# EAGLE design mptt-controller (EAGLE 9.6.1)

## Sheet 1 of 2
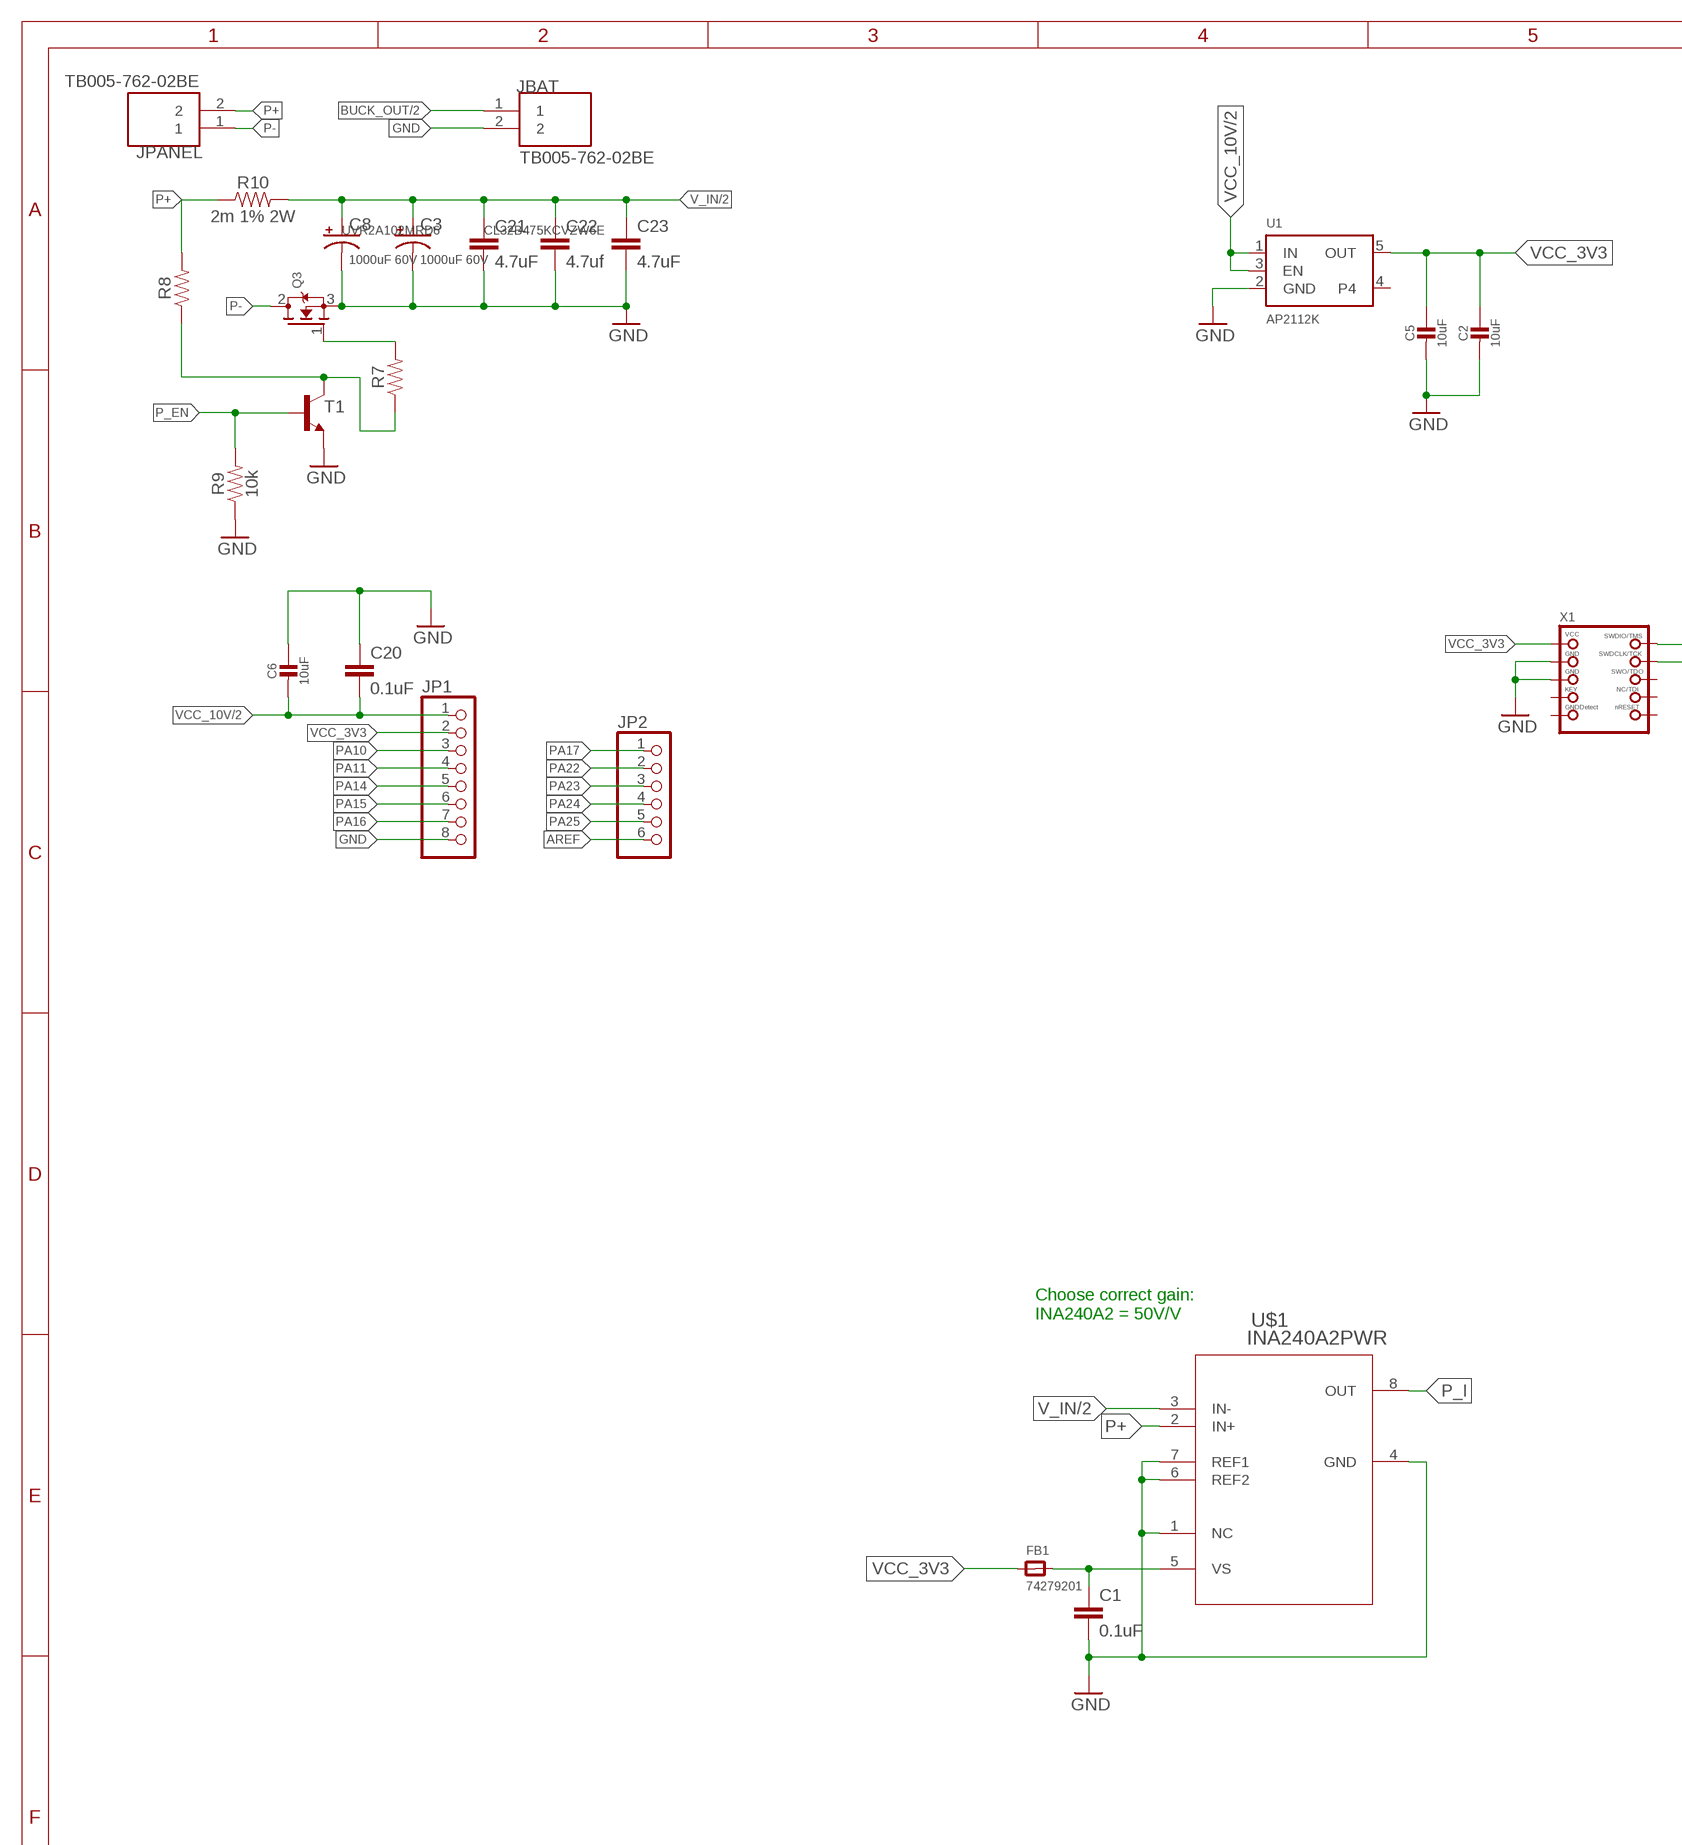
[diagram p0: schematic, sheet 1, part 1 of 2]
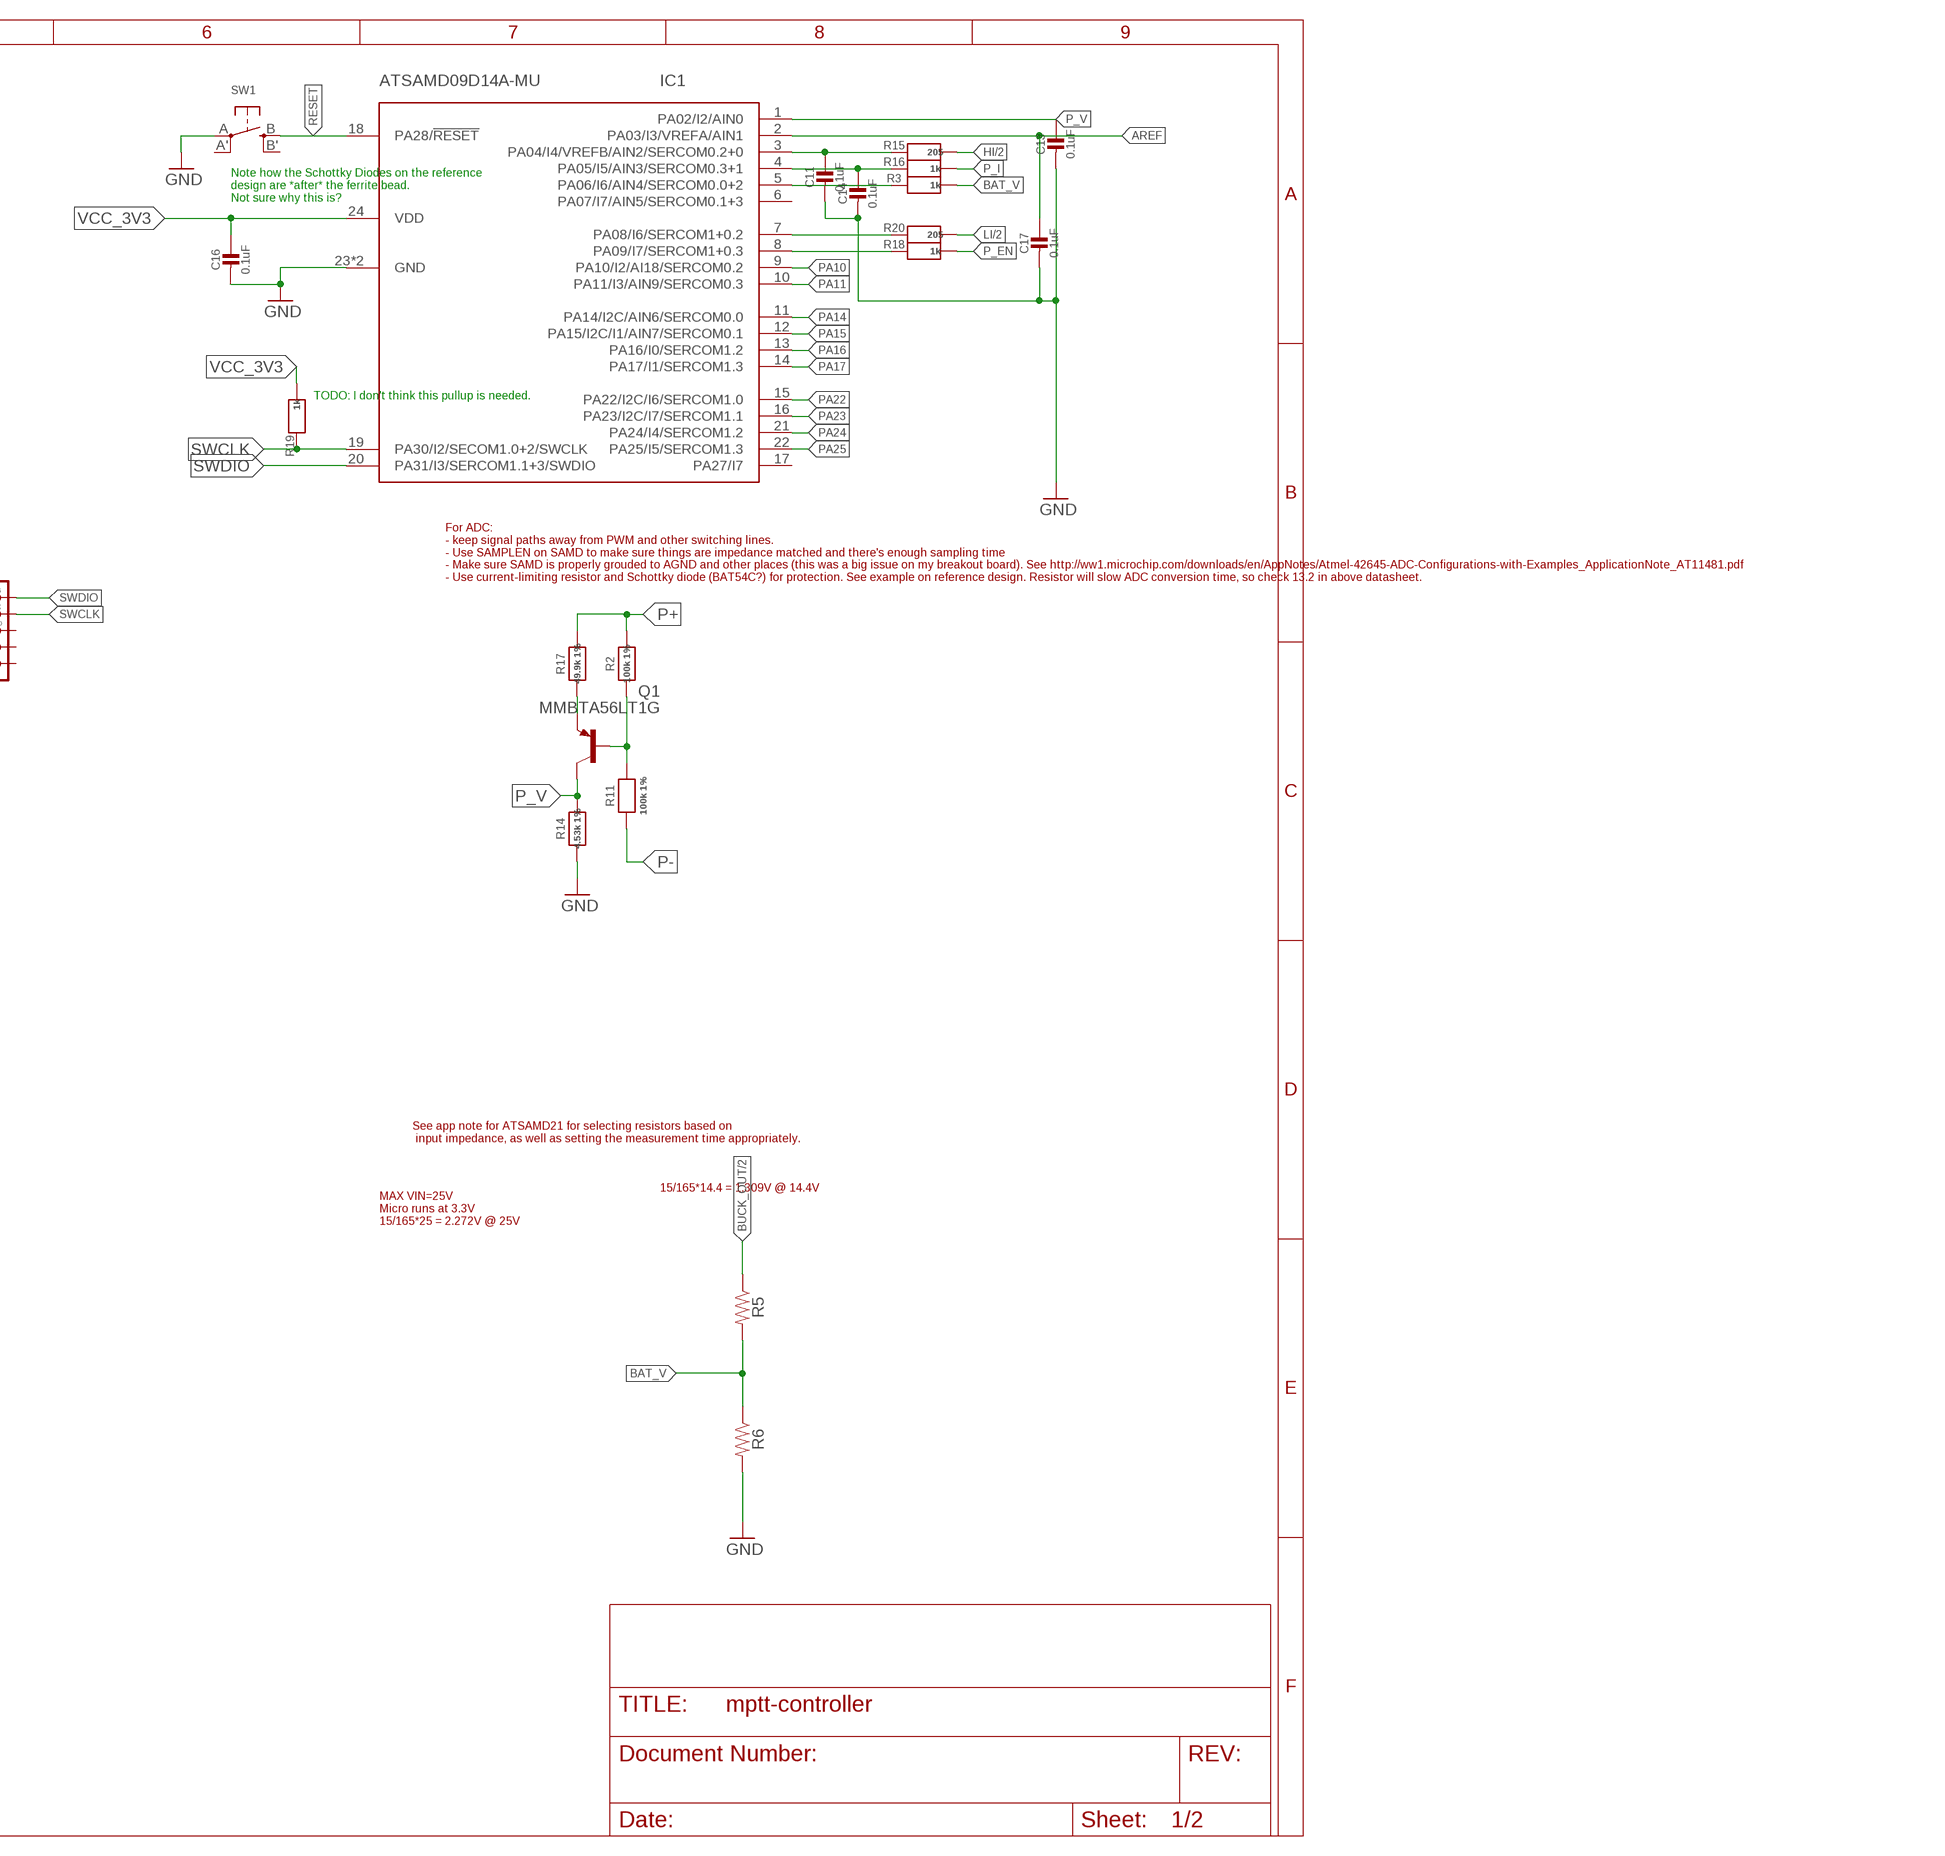
[diagram p1: schematic, sheet 1, part 2 of 2]

### Parts
C1  0.1uF  0.1UF-25V(+80/-20%)(0603)  [0603-CAP]
C2  10uF  CAP_CERAMIC_0805  [_0805]
C3  1000uF 60V  CAP_POLPTH4  [CPOL-RADIAL-1000UF-25V]
C5  10uF  CAP_CERAMIC_0805  [_0805]
C6  10uF  CAP_CERAMIC_0805  [_0805]
C8  1000uF 60V  CAP_POLPTH4  [CPOL-RADIAL-1000UF-25V]
C11  0.1uF  CAP_CERAMIC_0402MP  [_0402MP]
C13  0.1uF  CAP_CERAMIC_0402MP  [_0402MP]
C14  0.1uF  CAP_CERAMIC_0402MP  [_0402MP]
C16  0.1uF  CAP_CERAMIC_0402MP  [_0402MP]
C17  0.1uF  CAP_CERAMIC_0402MP  [_0402MP]
C20  0.1uF  0.1UF-25V(+80/-20%)(0603)  [0603-CAP]
C21  4.7uF  C-EUC1210  [C1210]
C22  4.7uf  C-EUC1210  [C1210]
C23  4.7uF  C-EUC1210  [C1210]
FB1  74279201  FERRITE_0805  [_0805]
IC1  ATSAMD09D14A-MU  [QFN24_4MM]
JBAT  TB005-762-02BE  [CUI_TB005-762-02BE]
JP1  HEADER-1X8ROUND  [1X08_ROUND]
JP2  HEADER-1X6ROUND  [1X06_ROUND]
JPANEL  TB005-762-02BE  [CUI_TB005-762-02BE]
Q1  MMBTA56LT1G  MMBTA92LT1SMD  [SOT23-BEC]
Q3  MOSFET-NGDS_TO220V  [TO220V]
R2  100k 1%  RESISTOR_0805MP  [_0805MP]
R3  1k  RESISTOR_0402MP  [_0402MP]
R5  RESISTOR0603  [0603]
R6  RESISTOR0603  [0603]
R7  RESISTOR0603  [0603]
R8  RESISTOR0603  [0603]
R9  10k  RESISTOR0603  [0603]
R10  2m 1% 2W  0.05OHM-2512-3W-1%  [2512]
R11  100k 1%  RESISTOR_0805MP  [_0805MP]
R14  4.53k 1%  RESISTOR_0805MP  [_0805MP]
R15  205  RESISTOR_0402MP  [_0402MP]
R16  1k  RESISTOR_0402MP  [_0402MP]
R17  49.9k 1%  RESISTOR_0805MP  [_0805MP]
R18  1k  RESISTOR_0402MP  [_0402MP]
R19  1k  RESISTOR_0402MP  [_0402MP]
R20  205  RESISTOR_0402MP  [_0402MP]
SW1  SWITCH_TACT_SMT4.6X2.8  [BTN_KMR2_4.6X2.8]
T1  MMBT3904LT1-NPN-SOT23-BEC  [SOT23-BEC]
U1  AP2112K  VREG_SOT23-5  [SOT23-5]
U$1  INA240A2PWR  INA240  [PW0008A_N]
X1  JTAG-CORTEXBOX  [2X05_1.27MM_BOX_NOPOSTS]

### Nets
AREF: C17.1 IC1.2(PA03/I3/VREFA/AIN1) JP2.6
BAT_V: R3.2 R5.2 R6.1
BUCK_OUT: JBAT.1 R5.1 ; also sheet 2
GND: C1.2 C2.2 C3.- C5.2 C6.1 C8.- C11.2 C13.2 C14.2 C16.2 C17.2 C20.1 C21.2 C22.2 C23.2 IC1.23(GND) IC1.THERM(GND) JBAT.2 JP1.8 Q3.3(S) R6.2 R9.1 R14.1 SW1.A(P) T1.E U1.2(GND) U$1.1(NC) U$1.4(GND) U$1.6(REF2) U$1.7(REF1) X1.3(GND) X1.5(GND) ; also sheet 2
HI: R15.2 ; also sheet 2
LI: R20.2 ; also sheet 2
N$1: IC1.7(PA08/I6/SERCOM1+0.2) R20.1
N$2: Q3.1(G) R7.2
N$3: IC1.8(PA09/I7/SERCOM1+0.3) R18.1
N$4: Q1.B R2.1 R11.2
N$5: Q1.E R17.1
N$6: C11.1 IC1.3(PA04/I4/VREFB/AIN2/SERCOM0.2+0) R15.1
N$9: R7.1 R8.1 T1.C
N$11: C14.1 IC1.4(PA05/I5/AIN3/SERCOM0.3+1) R16.1
N$17: IC1.5(PA06/I6/AIN4/SERCOM0.0+2) R3.1
P+: JPANEL.2 R2.2 R8.2 R10.P$1 R17.2 U$1.2(IN+)
P-: JPANEL.1 Q3.2(D) R11.1
P_EN: R9.2 R18.2 T1.B
P_I: R16.2 U$1.8(OUT)
P_V: C13.1 IC1.1(PA02/I2/AIN0) Q1.C R14.2
PA10: IC1.9(PA10/I2/AI18/SERCOM0.2) JP1.3
PA11: IC1.10(PA11/I3/AIN9/SERCOM0.3) JP1.4
PA14: IC1.11(PA14/I2C/AIN6/SERCOM0.0) JP1.5
PA15: IC1.12(PA15/I2C/I1/AIN7/SERCOM0.1) JP1.6
PA16: IC1.13(PA16/I0/SERCOM1.2) JP1.7
PA17: IC1.14(PA17/I1/SERCOM1.3) JP2.1
PA22: IC1.15(PA22/I2C/I6/SERCOM1.0) JP2.2
PA23: IC1.16(PA23/I2C/I7/SERCOM1.1) JP2.3
PA24: IC1.21(PA24/I4/SERCOM1.2) JP2.4
PA25: IC1.22(PA25/I5/SERCOM1.3) JP2.5
RESET: IC1.18(PA28/!RESET) SW1.B(S)
SWCLK: IC1.19(PA30/I2/SECOM1.0+2/SWCLK) R19.1 X1.4(SWDCLK)
SWDIO: IC1.20(PA31/I3/SERCOM1.1+3/SWDIO) X1.2(SWDIO)
V_IN: C3.+ C8.+ C21.1 C22.1 C23.1 R10.P$2 U$1.3(IN-) ; also sheet 2
VCC_3V3: C2.1 C5.1 C16.1 FB1.1 IC1.24(VDD) JP1.2 R19.2 U1.5(OUT) X1.1(VCC)
VCC_10V: C6.2 C20.2 JP1.1 U1.1(IN) U1.3(EN) ; also sheet 2
VS: C1.1 FB1.2 U$1.5(VS)
Unconnected: IC1.6(PA07/I7/AIN5/SERCOM0.1+3) IC1.17(PA27/I7) SW1.A'(P1) SW1.B'(S1) U1.4 X1.6(SWO) X1.7(KEY) X1.8(TDI) X1.9(GNDDETECT) X1.10(NRESET)

### Notes on the sheet
- Note how the Schottky Diodes on the reference 
  design are *after* the ferrite bead. 
  Not sure why this is?
- TODO: I don't think this pullup is needed.
- For ADC:
  - keep signal paths away from PWM and other switching lines.
  - Use SAMPLEN on SAMD to make sure things are impedance matched and there's enough sampling time
  - Make sure SAMD is properly grouded to AGND and other places (this was a big issue on my breakout board). See http://ww1.microchip.com/downloads/en/AppNotes/Atmel-42645-ADC-Configurations-with-Examples_ApplicationNote_AT11481.pdf
  - Use current-limiting resistor and Schottky diode (BAT54C?) for protection. See example on reference design. Resistor will slow ADC conversion time, so check 13.2 in above datasheet.
- See app note for ATSAMD21 for selecting resistors based on
   input impedance, as well as setting the measurement time appropriately.
- 15/165*14.4 = 1.309V @ 14.4V
- Choose correct gain:
  INA240A2 = 50V/V
- MAX VIN=25V
  Micro runs at 3.3V
  15/165*25 = 2.272V @ 25V

## Sheet 2 of 2
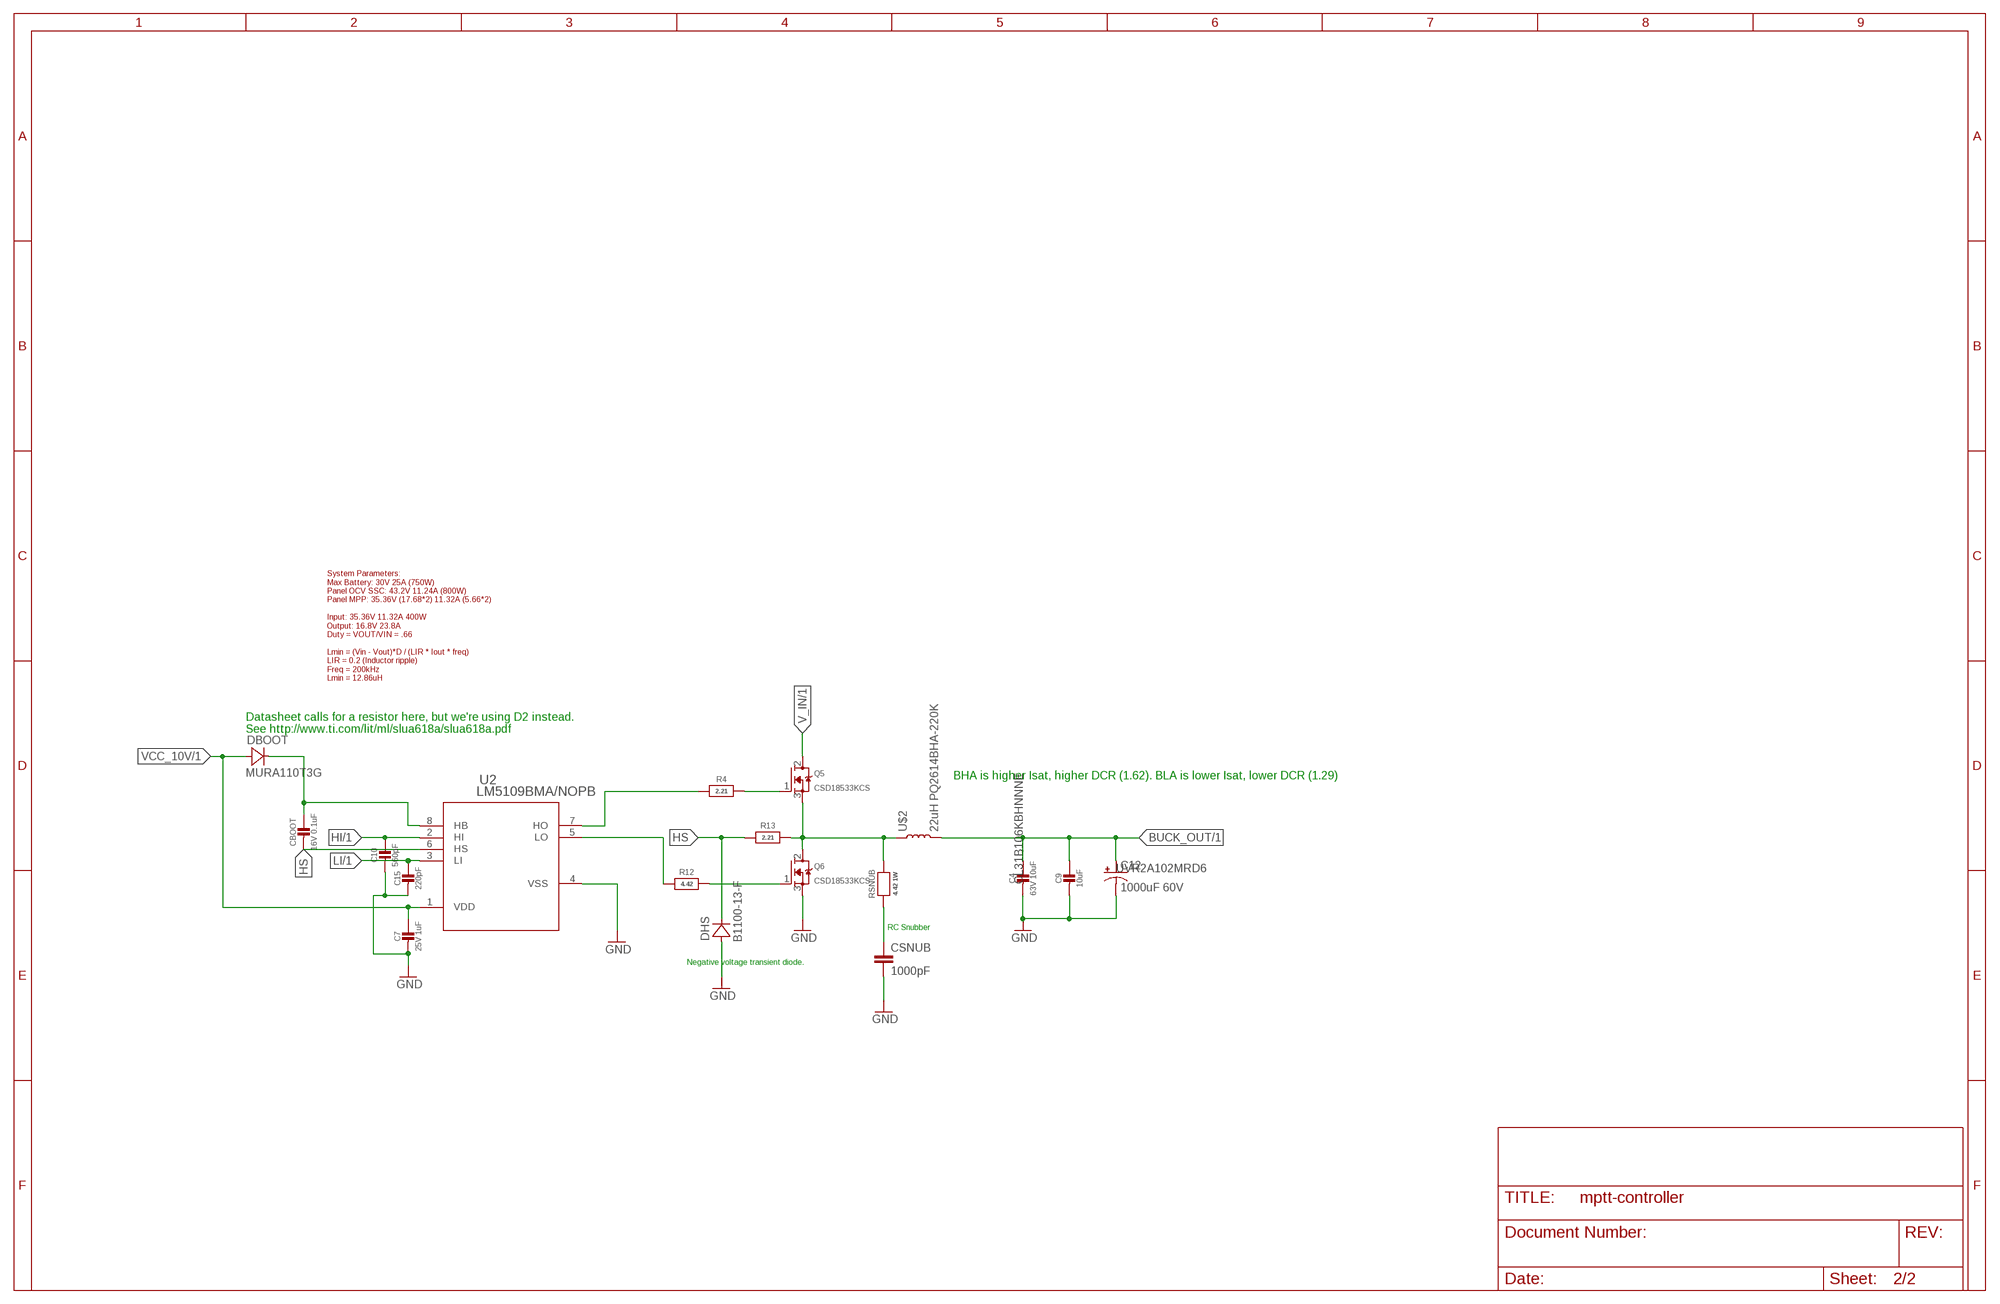
[diagram p2: schematic, sheet 2]

### Parts
C4  63V 10uF  CAP_CERAMIC_1206  [_1206]
C7  25V 1uF  CAP_CERAMIC_0805  [_0805]
C9  10uF  CAP_CERAMIC_1206  [_1206]
C10  560pF  CAP_CERAMIC_0603  [_0603]
C12  1000uF 60V  CAP_POLPTH4  [CPOL-RADIAL-1000UF-25V]
C15  220pF  CAP_CERAMIC_0603  [_0603]
CBOOT  16V 0.1uF  CAP_CERAMIC_0805  [_0805]
CSNUB  1000pF  0.1UF-25V(+80/-20%)(0603)  [0603-CAP]
DBOOT  MURA110T3G  MBRA340T3  [SMA]
DHS  B1100-13-F  MBRA340T3  [SMA]
Q5  CSD18533KCS  MOSFET-NGDS_TO220V  [TO220V]
Q6  CSD18533KCS  MOSFET-NGDS_TO220V  [TO220V]
R4  2.21  RESISTOR_0805  [_0805]
R12  4.42  RESISTOR_0805  [_0805]
R13  2.21  RESISTOR_0805  [_0805]
RSNUB  4.42 1W  RESISTOR2512  [2512]
U2  LM5109BMA/NOPB  [M08A_TEX]
U$2  22uH PQ2614BHA-220K  PQ2614  [PQ2614]

### Nets
BUCK_OUT: C4.1 C9.1 C12.+ U$2.P2 ; also sheet 1
GND: C4.2 C7.2 C9.2 C10.2 C12.- C15.2 CSNUB.2 DHS.A Q6.3(S) U2.4(VSS) ; also sheet 1
HB: CBOOT.1 DBOOT.C U2.8(HB)
HI: C10.1 U2.2(HI) ; also sheet 1
HO: R4.1 U2.7(HO)
HS: CBOOT.2 DHS.C R13.1 U2.6(HS)
LI: C15.1 U2.3(LI) ; also sheet 1
LO: R12.1 U2.5(LO)
N$13: Q5.1(G) R4.2
N$14: CSNUB.1 RSNUB.1
N$15: Q6.1(G) R12.2
SWITCH_NODE: Q5.3(S) Q6.2(D) R13.2 RSNUB.2 U$2.P1
V_IN: Q5.2(D) ; also sheet 1
VCC_10V: C7.1 DBOOT.A U2.1(VDD) ; also sheet 1

### Notes on the sheet
- System Parameters:
  Max Battery: 30V 25A (750W)
  Panel OCV SSC: 43.2V 11.24A (800W)
  Panel MPP: 35.36V (17.68*2) 11.32A (5.66*2)
  
  Input: 35.36V 11.32A 400W
  Output: 16.8V 23.8A 
  Duty = VOUT/VIN = .66
  
  Lmin = (Vin - Vout)*D / (LIR * Iout * freq)
  LIR = 0.2 (Inductor ripple)
  Freq = 200kHz
  Lmin = 12.86uH
- Datasheet calls for a resistor here, but we're using D2 instead. 
  See http://www.ti.com/lit/ml/slua618a/slua618a.pdf
- BHA is higher Isat, higher DCR (1.62). BLA is lower Isat, lower DCR (1.29)
- RC Snubber
- Negative voltage transient diode.

## Library data of the parts
C1 C20 = SparkFun-Capacitors:0.1UF-25V(+80/-20%)(0603): CAP-00810 Ceramic Standard decoupling cap; PROD_ID: CAP-00810
C2 C5-C7 C9 C11 C13 C14 C16 C17 CBOOT = ATSAMD09D14 Breakout rev B:CAP_CERAMIC: Ceramic Capacitors For new designs, use the packages preceded by an '_' character since they are more reliable: The following footprints should be used on most boards: _0402 - Standard footprint for regular board layouts _0603 - Standard footprint for regular board layouts _0805 - Standard footprint for regular board layouts _1206 - Standard footprint for regular board layouts For extremely tight-pitch boards where space is at a premium, the following 'micro-pitch' footprints can be used (smaller pads, no silkscreen outline, etc.): _0402MP - Micro-pitch footprint for very dense/compact boards _0603MP - Micro-pitch footprint for very dense/compact boards _0805MP - Micro-pitch footprint for very dense/compact boards _1206MP - Micro-pitch footprint for very dense/compact boards
C3 = SparkFun-Capacitors:CAP_POL: Capacitor Polarized These are standard SMD and PTH capacitors. Normally 10uF, 47uF, and 100uF in electrolytic and tantalum varieties. Always verify the external diameter of the through hole cap, it varies with capacity, voltage, and manufacturer. The EIA devices should be standard.
C4 = ATSAMD09D14 Breakout rev B:CAP_CERAMIC: Ceramic Capacitors For new designs, use the packages preceded by an '_' character since they are more reliable: The following footprints should be used on most boards: _0402 - Standard footprint for regular board layouts _0603 - Standard footprint for regular board layouts _0805 - Standard footprint for regular board layouts _1206 - Standard footprint for regular board layouts For extremely tight-pitch boards where space is at a premium, the following 'micro-pitch' footprints can be used (smaller pads, no silkscreen outline, etc.): _0402MP - Micro-pitch footprint for very dense/compact boards _0603MP - Micro-pitch footprint for very dense/compact boards _0805MP - Micro-pitch footprint for very dense/compact boards _1206MP - Micro-pitch footprint for very dense/compact boards; PN: CL31B106KBHNNNE
C8 C12 = SparkFun-Capacitors:CAP_POL: Capacitor Polarized These are standard SMD and PTH capacitors. Normally 10uF, 47uF, and 100uF in electrolytic and tantalum varieties. Always verify the external diameter of the through hole cap, it varies with capacity, voltage, and manufacturer. The EIA devices should be standard.; PARTNUM: UVR2A102MRD6
C10 C15 = Adafruit Metro M0 Express:CAP_CERAMIC: Ceramic Capacitors For new designs, use the packages preceded by an '_' character since they are more reliable: The following footprints should be used on most boards: _0402 - Standard footprint for regular board layouts _0603 - Standard footprint for regular board layouts _0805 - Standard footprint for regular board layouts _1206 - Standard footprint for regular board layouts For extremely tight-pitch boards where space is at a premium, the following 'micro-pitch' footprints can be used (smaller pads, no silkscreen outline, etc.): _0402MP - Micro-pitch footprint for very dense/compact boards _0603MP - Micro-pitch footprint for very dense/compact boards _0805MP - Micro-pitch footprint for very dense/compact boards _1206MP - Micro-pitch footprint for very dense/compact boards
C21 = rcl:C-EU: CAPACITOR, European symbol; PARTNUM: CL32B475KCVZW6E; SPICEPREFIX: C
C22 C23 = rcl:C-EU: CAPACITOR, European symbol; SPICEPREFIX: C
CSNUB = SparkFun-Capacitors:0.1UF-25V(+80/-20%)(0603): CAP-00810 Ceramic Standard decoupling cap; PROD_ID: CAP-00810; VALUE: 0.1uF
DBOOT DHS = diode:MBRA340T3: Surface Mount Schottky Power Rectifier Source: http://www.onsemi.com/pub_link/Collateral/MBRA340T3-D.PDF
FB1 = Adafruit Metro M0 Express:FERRITE: Ferrite Bead 0603 MMZ1608B121C - 120 Ohm @ 100MHz, 600mA, 0.15 Ohm DC Resistance - Digikey: 445-2164-1-ND BK1608HW121-T - 120 Ohm, 600mA Ferrite Chip - Digikey: 587-1876-2-ND 0805 HZ0805B272R-10 - 2.7K Ohm @ 100MHz, 200mA, 0.8 Ohm DC Resistance - Digikey: 240-2504-1-ND (see also Murata BLM21BD272SN1L) MMZ2012Y152B - 1.5K Ohm @ 100MHz, 500mA, 0.4 Ohm DC Resistance - Digikey: 445-1560-1-ND - Mainly for high frequency (80-400MHz) MMZ2012R102A - 1K Ohm @ 100MHz, 500mA, 0.3 Ohm DC Resistance - Digikey: 445-1555-2-ND - More general purpose (10-200MHz)
IC1 = ATSAMD09D14 Breakout rev B:ATSAMD09D14A
JBAT JPANEL = TB005-762-02BE:TB005-762-02BE; MANUFACTURER: CUI; STANDARD: Manufacturer Recommendations
JP1 = Adafruit Metro M0 Express:HEADER-1X8: PIN HEADER
JP2 = Adafruit Metro M0 Express:HEADER-1X6: PIN HEADER
Q1 = transistor-pnp:MMBTA92*: PNP Transistror
Q3 Q5 Q6 = adafruit:MOSFET-N: N-Channel Mosfet 2N7002E - 60V 260mA SOT23 [Digikey: 2N7002ET1GOSTR-ND] - REEL BSH103 - 30V 850mA SOT23 [Digikey: 568-5013-1-ND]
R2 R4 R11-R14 R17 RSNUB = Adafruit Metro M0 Express:RESISTOR: Resistors For new designs, use the packages preceded by an '_' character since they are more reliable: The following footprints should be used on most boards: _0402 - Standard footprint for regular board layouts _0603 - Standard footprint for regular board layouts _0805 - Standard footprint for regular board layouts _1206 - Standard footprint for regular board layouts For extremely tight-pitch boards where space is at a premium, the following 'micro-pitch' footprints can be used (smaller pads, no silkscreen outline, etc.): _0402MP - Micro-pitch footprint for very dense/compact boards _0603MP - Micro-pitch footprint for very dense/compact boards _0805MP - Micro-pitch footprint for very dense/compact boards _1206MP - Micro-pitch footprint for very dense/compact boards
R3 R15 R16 R18-R20 = ATSAMD09D14 Breakout rev B:RESISTOR: Resistors For new designs, use the packages preceded by an '_' character since they are more reliable: The following footprints should be used on most boards: _0402 - Standard footprint for regular board layouts _0603 - Standard footprint for regular board layouts _0805 - Standard footprint for regular board layouts _1206 - Standard footprint for regular board layouts For extremely tight-pitch boards where space is at a premium, the following 'micro-pitch' footprints can be used (smaller pads, no silkscreen outline, etc.): _0402MP - Micro-pitch footprint for very dense/compact boards _0603MP - Micro-pitch footprint for very dense/compact boards _0805MP - Micro-pitch footprint for very dense/compact boards _1206MP - Micro-pitch footprint for very dense/compact boards
R5-R9 = SparkFun-Resistors:RESISTOR: Generic Resistor Package
R10 = SparkFun-Resistors:0.05OHM: 0.05Ω resistor A resistor is a passive two-terminal electrical component that implements electrical resistance as a circuit element. Resistors act to reduce current flow, and, at the same time, act to lower voltage levels within circuits. - Wikipedia; PROD_ID: RES-13771; VALUE: 0.05
SW1 = Adafruit Metro M0 Express:SWITCH_TACT_SMT: SMT Tact Switches 6x6mm - Digikey: P12940SCT-ND KMR2 (4.6x2.8mm) - Digikey: 401-1426-1-ND EVQ-PQHB55 - Light Touch, 160GF (4.5x4.5mm) - Digikey: P8090SCT-ND KMT0 - KMT021 NGJ LHS (etc.) IP68/Waterproof - Digikey: CKN10289CT-ND
T1 = transistor-neu-to92:*-NPN-: NPN Transistror
U1 = ATSAMD09D14 Breakout rev B:VREG_SOT23-5: SOT23-5 Fixed Voltage Regulators Part Current Out V Out V In V Dropout θJA (°C/W) TJ (°C) Digikey Part No. ADP121 150mA 3.3V 3.4-5.5V 0.09V @ 150mA -- -- ADP121-AUJZ33R7CT-ND ADP121 150mA 3.0V 3.1-5.5V 0.09V @ 150mA -- -- ADP121-AUJZ30R7CT-ND ADP122 300mA 3.3V 3.4-5.5V 0.085V @ 300mA -- -- ADP122AUJZ-3.3-R7CT-ND ADP1712 300mA 3.3V 3.5-5.5V 0.17V @ 300mA -- -- ADP1712AUJZ-3.3-R7TR-ND AP7311 (Low Cost) 150mA 3.3V 3.5-6V 0.15V @ 150mA -- -- AP7311-33WG-7DICT-ND LD39015M18R 150mA 1.8V 1.9V-5.5V 0.08V @ 100mA -- -- 497-6977-1-ND LP2985A-33DBVR 150mA 3.3V 3.3-16V 0.28V @ 150mA 206 150 296-18479-1-ND MCP1824T-3302E/OT 300mA 3.3V 3.5V-6V 0.2V @ 300mA -- -- MCP1824T-3302E/OTCT-ND MIC5205-2.5YM5 TR 150mA 2.5V 2.7-16V 0.165V @ 150mA -- -- 576-1257-2-ND MIC5205-3.0YM5 TR 150mA 3.0V 3.2V-16V 0.165V @ 150mA -- -- 576-1258-2-ND MIC5205-3.3YM5 TR 150mA 3.3V 3.5V-16V 0.165V @ 150mA -- -- 576-1259-2-ND TPS780330220 150mA 3.3V+2.2V 3.6-5.5V 250mV Max -- -- 296-23332-1-ND TDA3663/N1,135 100mA 3.3V 3.5-45V 0.18V @ 50mA -- -- 568-5343-1-ND Max operating temp can be calculated using θJA, TJ (max junction temperature), and power in watts. Set the "Maximum Ambient Temperature" until it reaches TJ ("Max Junction Temperature"), which is the absolute limit for safe use of the regulator: Heat Sink Temperature Calculator <http://www.daycounter.com/Calculators/Heat-Sink-Temperature-Calculator.phtml> For example, With 12V source into a 3.3V LP2985 and a 30mA load, we are dissipating (12V-3.3V) * 0.03A = 0.261W. With a θJA of 206 °C/W, a TJ of 150°C, and 261mW we can safely use the chip without a heat sink up to 75°C (=147.1°C Junction Temperature).
U2 = TI:LM5109BMA/NOPB; BUILT_BY: EMA_UL_Team; COPYRIGHT: Copyright (C) 2018 Accelerated Designs. All rights reserved; MANUFACTURER_PART_NUMBER: LM5109BMA/NOPB; SOURCELIBRARY: National_2011-10-27; VENDOR: Texas Instruments
U$1 = TI:INA240
U$2 = bourns:PQ2614
X1 = Adafruit Metro M0 Express:JTAG-CORTEX: Serial Wire (SW-DP) Connector Standard 0.05" 10-pin connector is for use with the Cortex M and Cortex A SWD (serial wire debugger) interface (SW-DP) Connectors 2x05_1.27MM_SMT - Inexpensive surface-mount header with bare pins, compatible with standard 10-pin SWD cables (4UCON: 16846) 2x05_1.27MM_BOX_NOPOSTS - Polarised surface-mount box (4UCON with caps: 19735, without caps: 15117 2x05_1.27MM_BOX_POSTS - Polarised surface-mount box with mounting holes (4UCON: 20317) Pinout: http://infocenter.arm.com/help/topic/com.arm.doc.faqs/attached/13634/cortex_debug_connectors.pdf http://www.keil.com/peripherals/coresight/connectors.asp

## Board
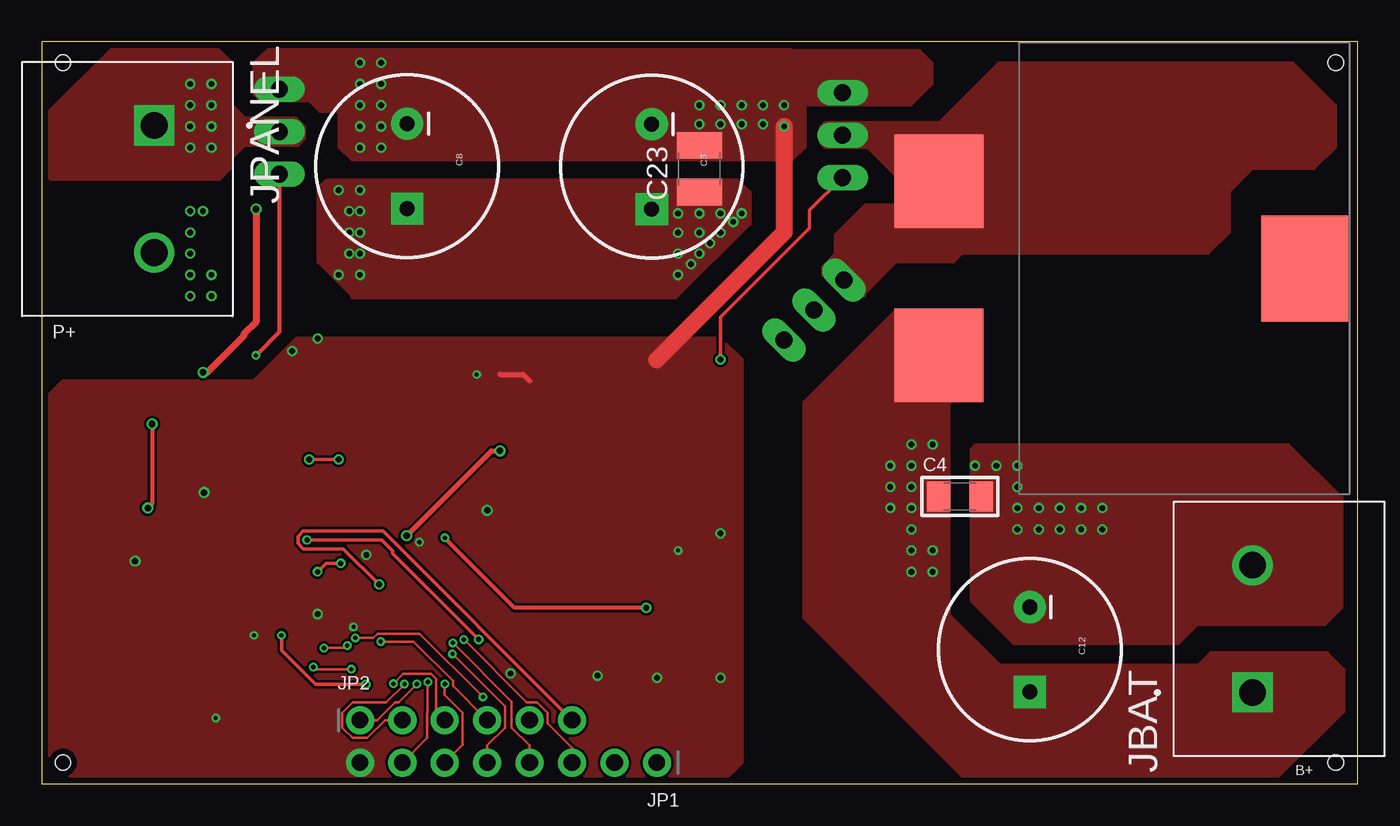
[diagram p3: board, top side]
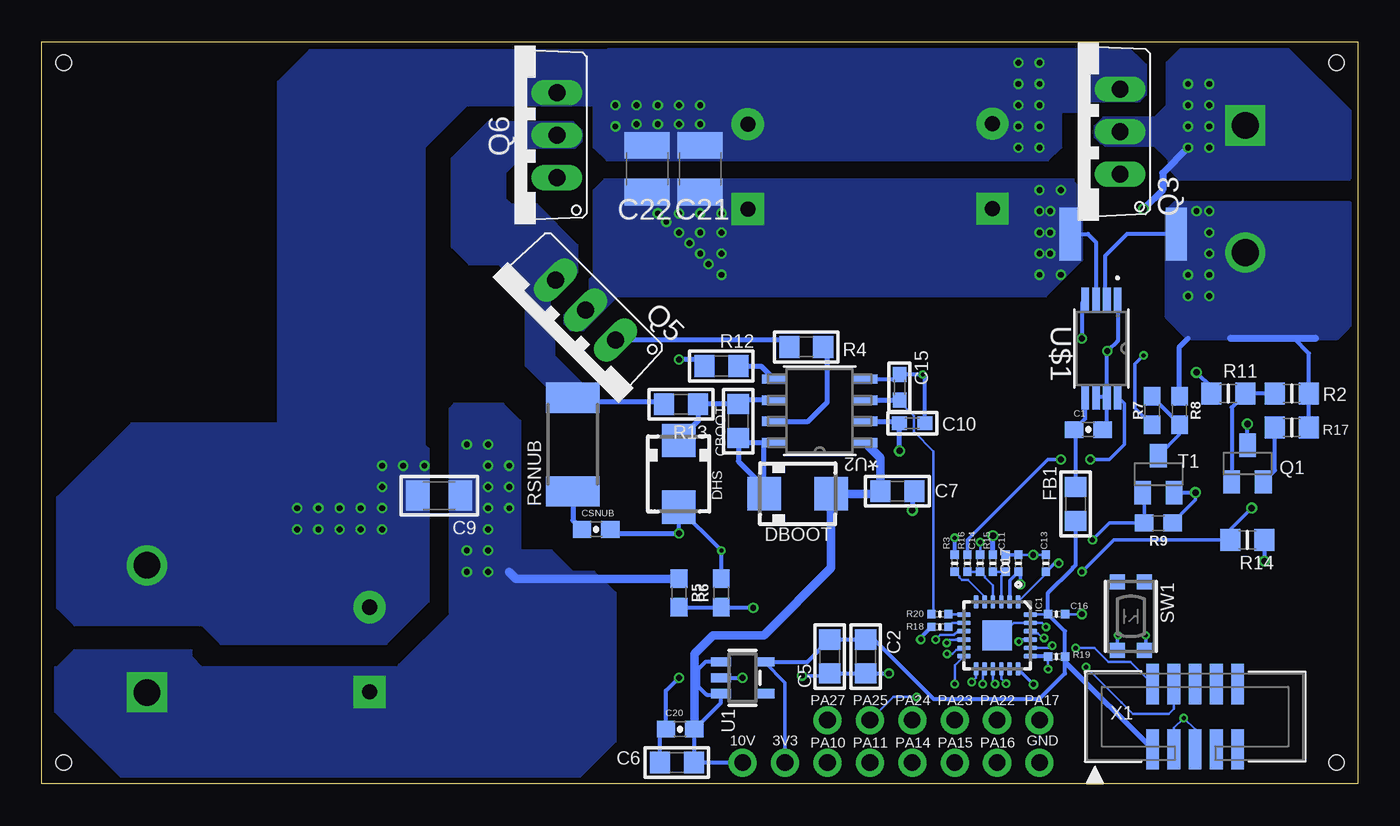
[diagram p4: board, bottom side, seen from below]

Size 78.79 x 44.44 mm. Coordinates in mm from the lower left corner, seen from the top.
Outline: 0,0 78.79,0 78.79,44.44 0,44.44 0,0
Copper layers (1*16): Top 0.035559375mm / dielectric 1.6mm / Bottom 0.035559375mm
Design rules "oshpark-2layer": minimum track width 6mil, minimum drill 10mil, track to track 6mil, track to pad 6mil, pad to pad 6mil, via to via 6mil, smd to smd 6mil, copper to edge 15mil, drill to drill 6mil, minimum pad ring 5mil, minimum via ring 5mil, stop-mask expansion 2.5mil, vias tented up to drill 0mil, thermal gap 10mil
Holes 0.9 mm at 77.47,43.18 1.27,43.18 77.47,1.27 1.27,1.27

### Footprints (pad centres in the part's own frame; a part is rotated, then mirrored left to right if it is on the bottom)
0603-CAP = smd 1.1 x 1: 1 -0.85,0; 2 0.85,0
_0805 = smd 1.2 x 1.3: 1 -1.016,0; 2 1.016,0
CPOL-RADIAL-1000UF-25V = drill 0.9 pad 1.93 square: + 2.54,0 | drill 0.9 pad 1.93: - -2.54,0
_1206 = smd 1.4 x 1.8: 1 -1.27,0; 2 1.27,0
_0603 = smd 0.9 x 0.8: 1 -0.762,0; 2 0.762,0
_0402MP = smd 0.5 x 0.5: 1 -0.508,0; 2 0.508,0
C1210 = smd 1.6 x 2.7: 1 -1.4,0; 2 1.4,0
SMA = smd 2 x 2: A 2,0; C -2,0
QFN24_4MM = smd 0.8 x 0.28: 1 -2,1.25; 2 -2,0.75; 3 -2,0.25; 4 -2,-0.25; 5 -2,-0.75; 6 -2,-1.25; 13 2,-1.25; 14 2,-0.75; 15 2,-0.25; 16 2,0.25; 17 2,0.75; 18 2,1.25 | smd 0.28 x 0.8: 7 -1.25,-2; 8 -0.75,-2; 9 -0.25,-2; 10 0.25,-2; 11 0.75,-2; 12 1.25,-2; 19 1.25,2; 20 0.75,2; 21 0.25,2; 22 -0.25,2; 23 -0.75,2; 24 -1.25,2 | smd 1.778 x 1.778: THERM 0,0
CUI_TB005-762-02BE = drill 1.6 square: 1 0,0 | drill 1.6: 2 7.62,0
1X08_ROUND = drill 1 pad 1.676: 1 -8.89,0; 2 -6.35,0; 3 -3.81,0; 4 -1.27,0; 5 1.27,0; 6 3.81,0; 7 6.35,0; 8 8.89,0
1X06_ROUND = drill 1 pad 1.676: 1 -6.35,0; 2 -3.81,0; 3 -1.27,0; 4 1.27,0; 5 3.81,0; 6 6.35,0
SOT23-BEC = smd 1 x 1.4: B -0.95,-1.1; C 0,1.1; E 0.95,-1.1
TO220V = drill 1.016 long: 1 -2.54,-2.54; 2 0,-2.54; 3 2.54,-2.54
_0805MP = smd 1.2 x 1.3: 1 -1.016,0; 2 1.016,0
0603 = smd 1.1 x 1: 1 -0.85,0; 2 0.85,0
2512 = smd 1.27 x 3.175: P$1 -3.175,0; P$2 3.175,0
2512' = smd 1.8 x 3.2: 1 -2.8,0; 2 2.8,0
BTN_KMR2_4.6X2.8 = smd 0.9 x 0.9: A 2.05,0.8; A' -2.05,0.8; B 2.05,-0.8; B' -2.05,-0.8
SOT23-5 = smd 0.55 x 1.2: 1 -0.95,-1.3; 2 0,-1.3; 3 0.95,-1.3; 4 0.95,1.3; 5 -0.95,1.3
M08A_TEX = smd 1.46 x 0.559: 1 -2.724,1.905; 2 -2.724,0.635; 3 -2.724,-0.635; 4 -2.724,-1.905; 5 2.724,-1.905; 6 2.724,-0.635; 7 2.724,0.635; 8 2.724,1.905
PW0008A_N = smd 1.499 x 0.457: 1 -2.9,0.975; 2 -2.9,0.325; 3 -2.9,-0.325; 4 -2.9,-0.975; 5 2.9,-0.975; 6 2.9,-0.325; 7 2.9,0.325; 8 2.9,0.975
PQ2614 = smd 5.588 x 5.334: P1 -0.762,-14.224; P2 9.652,-14.224 | smd 0.005 x 0.006: P$1 -19.05,8.89 | smd 6.35 x 5.283: P$2 4.445,7.722
2X05_1.27MM_BOX_NOPOSTS = smd 0.76 x 2.4: 1 -2.54,-1.95; 2 -2.54,1.95; 3 -1.27,-1.95; 4 -1.27,1.95; 5 0,-1.95; 6 0,1.95; 7 1.27,-1.95; 8 1.27,1.95; 9 2.54,-1.95; 10 2.54,1.95

### Placement (x,y rotation side)
C1  16.13,21.21 0 bottom
C2  29.46,7.62 270 bottom
C3  36.52,36.96 270 top
C4  54.97,17.21 0 top
C5  31.62,7.62 270 bottom
C6  40.77,1.27 0 bottom
C7  27.56,17.53 0 bottom
C8  21.88,36.99 270 top
C9  54.99,17.26 180 bottom
C10  26.67,21.59 0 bottom
C11  21.08,13.21 90 bottom
C12  59.16,8.04 270 top
C13  18.67,13.21 90 bottom
C14  22.61,13.21 90 bottom
C15  27.43,23.75 90 bottom
C16  18.03,10.16 0 bottom
C17  20.32,13.21 90 bottom
C20  40.57,3.28 0 bottom
C21  39.37,36.83 90 bottom
C22  42.54,36.83 90 bottom
C23  39.37,36.83 90 top
CBOOT  37.08,21.72 90 bottom
CSNUB  45.59,15.24 0 bottom
DBOOT  33.53,17.37 0 bottom
DHS  40.66,18.56 270 bottom
FB1  16.89,16.76 90 bottom
IC1  21.59,8.89 270 bottom
JBAT  72.49,5.47 90 top
JP1  27.94,1.27 180 top
JP2  25.4,3.81 0 top
JPANEL  6.73,39.43 270 top
Q1  6.6,19.18 0 bottom
Q3  16.77,39.06 90 bottom
Q5  48.03,26.58 135 bottom
Q6  50.48,38.85 90 bottom
R2  3.94,23.37 0 bottom
R3  24.13,13.21 90 bottom
R4  33.02,26.16 180 bottom
R5  40.64,11.43 270 bottom
R6  38.1,11.43 90 bottom
R7  12.32,22.35 270 bottom
R8  10.67,22.35 90 bottom
R9  11.94,15.62 180 bottom
R10  14.04,32.92 180 bottom
R11  7.75,23.37 0 bottom
R12  38.1,25.02 180 bottom
R13  40.51,22.73 180 bottom
R14  6.6,14.6 180 bottom
R15  21.84,13.21 90 bottom
R16  23.37,13.21 90 bottom
R17  3.94,21.34 0 bottom
R18  25.02,9.4 180 bottom
R19  18.03,7.62 0 bottom
R20  25.02,10.16 180 bottom
RSNUB  4.42 1W  [2512']  46.99,20.32 90 bottom
SW1  13.59,10.03 270 bottom
T1  11.94,18.54 0 bottom
U1  36.83,6.35 270 bottom
U2  32.22,22.34 180 bottom
U$1  15.35,26.07 270 bottom
U$2  67.95,35.31 270 top
X1  9.74,4.02 0 bottom

### Tracks (layer width: path | path; a pad name or v marks a point on that pad's centre or on a via)
AREF  (via drill 0.35)
  Top 0.203: JP2.6 20.42,15.14 15.66,15.14 15.34,14.83 15.34,14.38 15.66,14.07 18.06,14.07 v20.19,11.94
  Bottom 0.203: IC1.2 20.84,12.18 C17.1 20.19,12.57 v20.19,11.94
BAT_V  (via drill 0.25, 0.35)
  Top 0.254: v24.13,14.73 28.32,10.54 v36.2,10.54
  Bottom 0.254: R5.2 R6.1 36.23,10.58 v36.2,10.54 | R3.2 v24.13,14.73
BUCK_OUT  (via drill 0.35)
  Bottom 0.508: R5.1 50.38,12.28 50.8,12.7
  other vias: 53.34,20.32 52.07,20.32 52.07,19.05 52.07,17.78 52.07,16.51 52.07,15.24 52.07,13.97 53.34,13.97 53.34,12.7 52.07,12.7 50.8,16.51 50.8,17.78 50.8,19.05
  pour Top (no thermals): 55.88,24.26 54.36,22.73 54.36,10.16 57.4,7.11 69.22,7.11 69.98,7.87 76.96,7.87 77.98,6.86 77.98,4.32 73.66,0 55.5,0 45.59,9.91 45.59,22.86 51.05,28.32 51.82,28.32
  pour Bottom (no thermals): 54.36,22.48 54.36,10.16 57.4,7.11 57.4,6.99 69.22,6.99 69.85,7.62 69.85,8 76.84,8 77.85,6.99 77.98,6.99 77.98,4.32 73.66,0 55.5,0 50.16,5.33 50.16,21.72 51.18,22.73 54.1,22.73
  pour Bottom (no thermals): 50.8,13.97 48.26,13.97 46.99,12.7 45.72,12.7 44.45,11.43 44.45,2.54 46.99,0 55.88,0 55.88,6.35 50.8,11.43
GND  (via drill 0.25, 0.35, 0.4)
  Top 0.305: C15.2 28.83,24.51 29.21,24.13
  Top 1.016: v44.45,39.37 44.45,33.02 36.83,25.4
  Bottom 0.152: C13.2 v19.43,13.72 C11.2 | C14.2 v22.61,14.48 | C16.2 v16.51,10.16 | 20.96,9.27 20.83,9.4 20.59,9.64 IC1.23 18.91,9.64 v18.67,9.4 | X1.3 11.01,3.34 v10.41,3.94 9.74,3.26 X1.5
  Bottom 0.2: v9.72,17.44 9.72,16.99 R9.1 | SW1.A 12.7,8.07 v12.7,8.89 | 21.34,8.89 20.83,9.4
  Bottom 0.203: C17.2 C11.2 | C5.2 31.75,6.48 v33.27,6.48
  Bottom 0.254: C6.1 41.78,2.91 C20.1 41.42,5.57 v40.64,6.35 | C5.2 C2.2 v28.07,6.6 | U1.2 v36.83,6.35 | R6.2 v38.1,13.97 40.66,16.53 DHS.A 40.66,15.01 v40.64,14.99 | U$1.4 16.51,28.79 v16.51,26.67 | U$1.1 14.37,26.52 v14.99,25.91 15.02,25.87 U$1.7 | C1.2 15.02,21.47 U$1.7 | U$1.7 U$1.6 | R9.1 10.86,15.85 | IC1.THERM 21.34,8.89 | U2.4 27.7,24.24 C15.2 v26.04,24.51 25.91,24.38 C10.2 | R14.1 v5.59,13.33 | T1.E v9.72,17.44
  Bottom 0.305: C7.2 26.67,17.4 v26.67,16.38 | CSNUB.2 44.49,14.99 v40.64,14.99
  other vias: 58.42,16.51 59.69,16.51 60.96,16.51 62.23,16.51 63.5,16.51 63.5,15.24 62.23,15.24 60.96,15.24 59.69,15.24 58.42,15.24 20.32,38.1 19.05,38.1 19.05,39.37 20.32,39.37 20.32,40.64 19.05,40.64 19.05,41.91 20.32,41.91 20.32,43.18 19.05,43.18 39.37,39.5 40.64,39.5 41.91,39.5 43.18,39.5 44.45,40.64 43.18,40.64 41.91,40.64 40.64,40.64 39.37,40.64 58.42,17.78 58.42,19.05 57.15,19.05 55.88,19.05
  pour Bottom (no thermals): 13.97,40.89 13.08,40.89 12.7,41.27 12.7,41.91 12.7,43.05 13.97,44.32 14.1,44.45 44.45,44.45 45.72,43.18 45.72,38.1 44.96,37.34 18.54,37.34 17.78,38.1 17.78,40.26 16.64,40.26 16,40.89
  pour Top (no thermals): 45.72,43.18 44.45,44.45 13.97,44.45 12.7,43.18 12.7,41.27 12.95,41.02 12.95,40.89 16,40.89 16.64,40.26 17.78,40.26 17.78,38.1 18.54,37.34 44.96,37.34 45.72,38.1
  pour Top (no thermals): 45.72,40.64 52.07,40.64 53.34,41.91 53.34,43.18 52.58,43.94 44.96,43.94 44.96,41.4
  pour Bottom (no thermals): 44.96,43.94 62.74,43.94 64.64,42.04 64.64,19.05 55.88,19.05 55.88,38.1 53.34,40.64 44.45,40.64
  pour Bottom (no thermals): 57.15,21.59 55.63,20.07 55.63,19.69 55.63,10.92 58.17,8.38 68.07,8.38 69.22,9.53 76.84,9.53 77.85,10.54 77.85,17.15 73.41,21.59
  pour Top (no thermals): 77.85,10.54 76.84,9.53 69.22,9.53 68.07,8.38 58.17,8.38 55.63,10.92 55.63,20.07 55.88,20.32 74.68,20.32 77.85,17.15
  pour Top (no thermals): 40.64,26.67 15.24,26.67 12.7,24.13 1.27,24.13 0,22.86 0,0 40.64,0 41.91,1.27 41.91,25.4
HB
  Bottom 0.305: 35.56,20.44 36.82,20.44 CBOOT.1 37.08,19.3 35.56,17.78 | 35.56,20.44 U2.8 | DBOOT.C 35.56,17.4 35.56,17.78 | 35.56,17.78 35.56,20.44
HI  (via drill 0.4)
  Top 0.305: v21.84,14.86 26.92,19.94 v27.43,19.94
  Bottom 0.305: U2.2 27.55,21.7 C10.1 v27.43,19.94 | R15.2 v21.84,14.86
HO
  Bottom 0.305: U2.7 32.9,21.7 31.75,22.86 31.75,25.91 R4.1
HS
  Bottom 0.305: U2.6 36.84,22.98 CBOOT.2 R13.1 39.5,21.72 DHS.C
LI
  Bottom 0.152: R20.2 25.4,10.29 25.4,19.91 26.59,21.09 26.59,22.02 27.55,22.98
  Bottom 0.305: U2.3 27.55,22.98 27.54,22.99 C15.1
LO
  Bottom 0.305: R12.1 35.72,25.02 U2.5
N$1
  Bottom 0.152: IC1.7 23.61,10.16 R20.1
N$2  (via drill 0.25)
  Top 0.254: Q3.1 14.23,27.05 v12.83,25.65
  Bottom 0.2: R7.2 13.34,22.52 13.34,25.15 v12.83,25.65
N$3
  Bottom 0.152: R18.1 24.27,9.64 IC1.8
N$4
  Bottom 0.254: R2.1 R11.2 7.55,22.55 Q1.B
N$5
  Bottom 0.254: Q1.E 4.95,18.78 R17.1
N$6
  Bottom 0.152: IC1.3 21.34,12.44 C11.1 R15.1
N$9
  Bottom 0.2: R8.1 10.67,20.91 T1.C
  Bottom 0.254: R7.1 10.67,21.55 R8.1
N$11
  Bottom 0.152: IC1.4 21.84,11.87 22.32,12.35 22.32,12.42 C14.1 R16.1
N$13
  Bottom 0.305: R4.2 34.45,26.58 Q5.1
N$14
  Bottom 0.305: RSNUB.1 46.99,15.79 CSNUB.1
N$15  (via drill 0.35)
  Top 0.203: v40.64,25.4 40.64,27.94 45.97,33.27 45.97,34.34 Q6.1
  Bottom 0.305: R12.2 39.5,25.4 v40.64,25.4
N$17
  Bottom 0.152: R3.1 23.85,12.42 23.85,12.35 23.71,12.22 23.35,12.22 22.34,11.21 IC1.5
P+  (via drill 0.35)
  Bottom 0.254: R10.P$1 13.82,32.92 15.11,31.62 15.11,29.59 15.02,29.5 U$1.2 | R17.2 R2.2 2.92,25.78 3.81,26.67
  Bottom 0.305: R8.2 10.67,26.16 10.16,26.67
  Bottom 0.406: 2.54,26.67 3.81,26.67 7.62,26.67
  other vias: 8.89,33.02 8.89,31.75 8.89,30.48 8.89,29.21 10.16,29.21 10.16,30.48 8.89,34.29 9.65,34.29
  pour Bottom (no thermals): 11.43,34.29 10.92,34.8 10.16,34.8 0.51,34.8 0,34.29 0,27.94 1.27,26.67 10.16,26.67 11.43,27.94
P-  (via drill 0.35, 0.4)
  Top 0.406: v12.83,34.42 12.83,27.66 12.09,26.92 12.09,26.82 9.91,24.64 v9.65,24.64
  Bottom 0.254: v9.65,24.64 8.76,23.75 R11.1
  Bottom 0.406: v10.16,38.1 11.68,36.58 11.68,35.56 v12.83,34.42
  other vias: 8.89,38.1 8.89,39.37 10.16,39.37 10.16,40.64 8.89,40.64 8.89,41.91 10.16,41.91
  pour Bottom (no thermals): 11.43,43.18 11.43,40.64 12.19,39.88 15.24,39.88 15.75,39.37 15.75,38.73 15.37,38.35 15.24,38.35 15.11,38.23 12.19,38.23 11.3,37.34 11.3,36.83 10.67,36.2 0.51,36.2 0,36.7 0,39.88 4.57,44.45 10.16,44.45
  pour Top (no thermals): 11.43,43.18 10.16,44.45 4.57,44.45 0,39.88 0,36.7 0.51,36.2 10.67,36.2 11.3,36.83 11.3,37.34 12.19,38.23 15.37,38.23 15.75,38.61 15.75,39.37 15.24,39.88 12.19,39.88 11.3,40.77 11.3,43.05
P_EN  (via drill 0.3)
  Top 0.2: v26.16,8.64 21,13.8 21,13.95 20.34,14.6 v15.88,14.6
  Bottom 0.2: v15.88,14.6 14.86,15.62 R9.2 12.79,17.34 T1.B
  Bottom 0.254: R18.2 26.16,8.76 v26.16,8.64
P_I  (via drill 0.35)
  Top 0.203: v17.78,19.43 v16,19.43
  Bottom 0.203: R16.2 23.37,14.6 18.54,19.43 v17.78,19.43 | v16,19.43 14.86,19.43 13.97,20.32 13.97,22.77 U$1.8
P_V  (via drill 0.3, 0.4)
  Top 0.2: v17.91,13.21 17.02,13.21 v16.51,12.7
  Top 0.254: v6.6,21.55 6.6,16.76 v6.35,16.51
  Bottom 0.152: IC1.1 18.67,12.56 C13.1
  Bottom 0.2: v6.35,16.51 7.62,15.24 R14.2 14.61,14.6 v16.51,12.7 | C13.1 18.16,13.21 v17.91,13.21
  Bottom 0.254: Q1.C v6.6,21.55
PA10  (via drill 0.25)
  Top 0.152: JP1.3 31.75,2.16 30.28,3.63 30.28,4.25 29.65,4.88 29.03,4.88 v25.27,8.64
  Bottom 0.152: IC1.9 23.95,9.14 24.17,8.92 24.99,8.92 v25.27,8.64
PA11  (via drill 0.25)
  Top 0.152: v24.61,8.44 28.14,4.91 28.14,3.37 29.21,2.3 JP1.4
  Bottom 0.152: IC1.10 24.02,8.64 24.04,8.62 24.43,8.62 v24.61,8.44
PA14  (via drill 0.25)
  Top 0.152: JP1.5 26.67,2.3 27.74,3.37 27.74,4.63 v24.59,7.78
  Bottom 0.152: IC1.11 23.72,8.01 24.04,8.01 24.28,7.78 v24.59,7.78
PA15  (via drill 0.25)
  Top 0.152: v24.13,5.97 24.13,5.32 25.2,4.25 25.2,2.34 JP1.6
  Bottom 0.152: IC1.12 24.13,7.1 v24.13,5.97
PA16  (via drill 0.25)
  Top 0.152: v23.11,6.1 23.11,4.3 23.06,4.25 23.06,2.74 JP1.7
  Bottom 0.152: IC1.13 22.86,6.87 22.86,6.35 v23.11,6.1
PA17  (via drill 0.25)
  Top 0.152: v22.45,5.97 21.36,4.88 21.15,4.88 20.08,3.81 JP2.1
  Bottom 0.152: IC1.14 22.45,6.78 v22.45,5.97
PA22  (via drill 0.25)
  Top 0.152: JP2.2 20.56,3.81 19.49,2.74 18.61,2.74 17.98,3.37 17.98,4.25 18.61,4.88 20.62,4.88 v21.72,5.97
  Bottom 0.152: IC1.15 21.84,6.09 v21.72,5.97
PA23  (via drill 0.25)
  Top 0.152: JP2.3 23.6,4.34 23.6,6.3 23.31,6.58 21.64,6.58 v21.06,5.99
  Bottom 0.152: IC1.16 21.34,6.27 v21.06,5.99
PA24  (via drill 0.25)
  Top 0.152: JP2.4 24.61,5.87 24.61,6.17 22.27,8.51 v20.3,8.51
  Bottom 0.152: IC1.21 20.16,8.64 v20.3,8.51
PA25  (via drill 0.25)
  Top 0.152: v18.78,8.74 19.84,8.74 20.09,8.99 22.63,8.99 v26.42,5.21
  Bottom 0.152: IC1.22 19.46,9.01 19.14,9.01 18.87,8.74 v18.78,8.74 | v26.42,5.21 27.81,5.21 JP2.5
RESET  (via drill 0.25, 0.3)
  Top 0.2: v19.41,5.95 16.41,5.95 14.35,8 v14.35,8.89
  Bottom 0.2: v19.41,5.95 v19.41,5.96 IC1.18 | v14.35,8.89 14.39,8.85 SW1.B
SWCLK  (via drill 0.25)
  Top 0.152: v18.54,6.86 16.38,6.86 v16.26,6.99
  Bottom 0.152: v16.26,6.99 14.16,4.89 13.46,4.19 11.3,4.19 11.01,4.49 X1.4 | v18.54,6.86 R19.1
  Bottom 0.254: R19.1 18.56,7.64 IC1.19
SWDIO  (via drill 0.25)
  Top 0.152: v16.89,8.13 18.14,8.13 v18.29,8.28
  Bottom 0.152: X1.2 13.61,7.3 14.93,7.3 15.76,8.13 v16.89,8.13 | v18.29,8.28 18.42,8.14 IC1.20
SWITCH_NODE
  Bottom 0.305: R13.2 41.66,22.86 46.73,22.86 RSNUB.2
  pour Top (no thermals): 48.01,29.21 46.74,30.48 46.74,30.99 47.5,31.75 47.5,32.89 49.28,34.67 56.39,34.67 56.39,33.02 54.61,31.24 51.18,31.24 49.28,29.34 49.28,29.21
  pour Top (no thermals): 46.61,39.37 46.61,38.35 46.86,38.1 49.4,38.1 51.94,35.56 54.36,35.56 54.36,38.99 53.72,39.62 46.86,39.62
  pour Bottom (no thermals): 47.5,32.26 49.78,29.97 49.78,25.02 47.12,22.35 45.97,23.49 48.13,25.65 48.13,27.05 48.39,27.3 48.39,28.96 46.74,30.61 46.74,32.26
  pour Top (no thermals): 54.48,31.24 54.99,31.75 69.85,31.75 71.12,33.02 71.12,35.43 72.52,36.83 76.2,36.83 77.47,38.1 77.47,40.64 74.93,43.18 57.28,43.18 52.77,38.67 54.61,36.83 54.61,31.75 54.48,31.62
  pour Bottom (no thermals): 49.53,29.21 51.43,31.12 51.69,31.12 53.21,31.12 54.23,32.13 54.23,32.26 54.23,37.46 52.07,39.62 46.99,39.62 46.48,39.12 46.48,38.48 46.86,38.1 49.53,38.1 51.05,36.58 51.05,35.31 51.05,35.05 50.67,34.67 49.15,34.67 46.74,32.26 46.74,32
V_IN  (via drill 0.35)
  Bottom 0.254: R10.P$2 16.16,32.92 15.67,32.44 U$1.3
  other vias: 18.41,34.29 18.41,33.02 19.05,33.02 19.05,34.29 19.05,35.56 17.78,35.56 18.41,31.75 19.05,31.75 19.05,30.48 17.78,30.48 39.37,34.16 40.64,34.16 39.37,33.02 38.1,30.48 39.37,31.75 38.1,31.75 38.1,33.02 38.1,34.16 40.64,33.02 41.91,34.16 41.4,33.66 40,32.38 38.86,31.12
  pour Bottom (no thermals): 45.72,35.56 45.72,30.48 44.45,29.21 18.67,29.21 16.51,31.37 16.51,35.56 17.02,36.07 17.02,36.2 45.08,36.2
  pour Bottom (no thermals): 47.37,28.19 47.5,28.07 47.5,27.56 47.12,27.18 46.99,27.18 46.35,27.18 43.94,29.59 43.81,29.59 44.7,30.48 45.08,30.48 45.72,30.48 45.97,30.23 45.97,29.59 47.24,28.32 47.24,28.19
  pour Top (no thermals): 17.02,36.2 16.51,35.69 16.51,35.56 16.51,31.24 18.54,29.21 18.54,29.08 37.97,29.08 38.1,29.21 42.42,33.53 42.42,34.16 42.42,35.43 41.66,36.2 17.14,36.2 17.02,36.07
VCC_3V3
  Bottom 0.152: C16.1 19.57,10.16 IC1.24
  Bottom 0.203: U1.5 34.29,6.06 JP1.2
  Bottom 0.254: U1.5 32.96,7.3 C5.1 C2.1 28.96,8.64 25.4,5.08 19.05,5.08 17.53,6.6 R19.2 17.53,9.14 C16.1 18.54,11.43 17.07,12.91 17.07,12.93 16.89,13.11 FB1.1
  Bottom 0.305: R19.2 17.53,7.32 X1.1
VCC_10V
  Bottom 0.254: JP1.1 C6.2 39.72,1.3 C20.2 38.13,4.87 38.13,5.33 | 38.13,5.33 U1.3 | U1.1 39.05,7.3 39.5,6.86 39.5,5.84 38.99,5.33 38.13,5.33
  Bottom 0.305: 28.73,17.37 C7.1 | 29.3,20.23 U2.1
  Bottom 0.508: C20.2 39.72,7.78 38.61,8.89 35.56,8.89 31.53,12.92 DBOOT.A 28.73,17.37 | C7.1 28.57,19.51 29.3,20.23
VS
  Bottom 0.254: FB1.2 16.89,21.12 C1.1 16.32,21.87 U$1.5

### Text on the board
tNames: P+ | B+
bNames: PA17 | PA22 | PA23 | PA24 | PA25 | PA27 | GND | PA16 | PA15 | PA14 | PA11 | PA10 | 3V3 | 10V